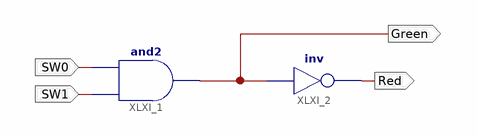
[diagram p0: schematic sheet 1]
// Xilinx ISE schematic Logic.sch (zynq) as structural Verilog: 2 symbols, 4 ports
module Logic (
  input  SW0,
  input  SW1,
  output Green,
  output Red
);

  and XLXI_1 (Green, SW1, SW0);
  not XLXI_2 (Red, Green);
endmodule
